# Altium schematic sheet Connectors.SchDoc
size A4; SheetNumber: 3; SheetTotal: 5
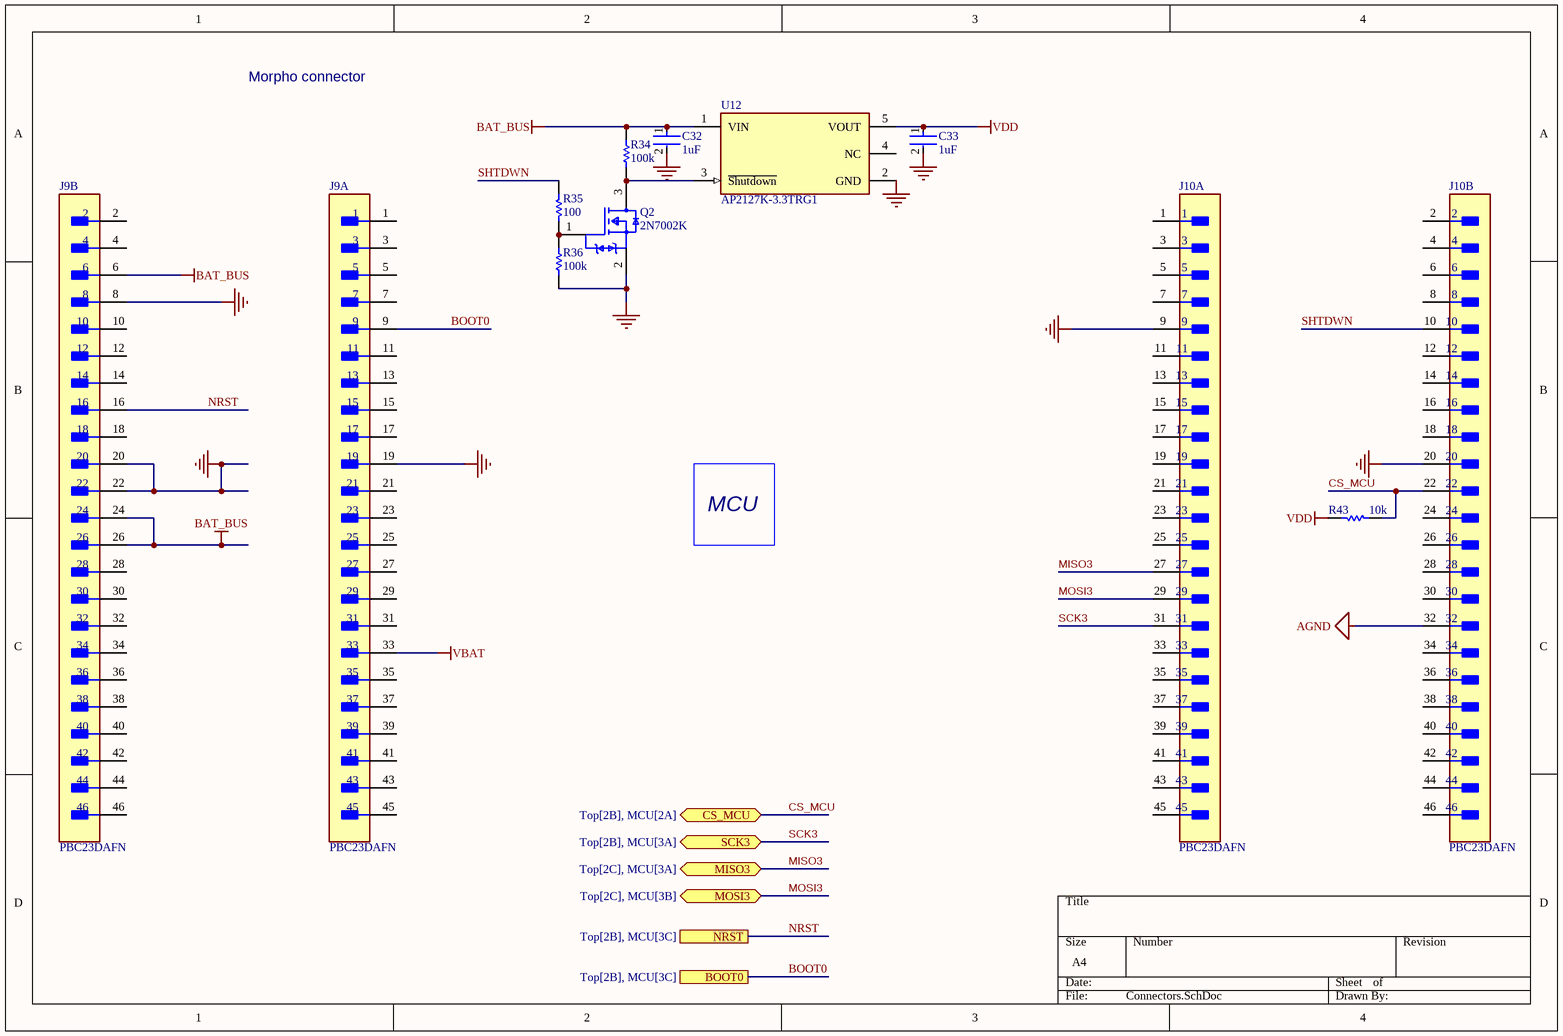
[diagram p0: Connectors.SchDoc]

## Parts
C32  1uF  [FP-0603-L_1_6_0_15-W_0_81-IPC_B]
C33  1uF  [FP-0603-L_1_6_0_15-W_0_81-IPC_B]
J9  PBC23DAFN  [FP-PBC23DAFN-MFG]  (parts A,B of 2)
J10  PBC23DAFN  [FP-PBC23DAFN-MFG]  (parts A,B of 2)
Q2  2N7002K  [FP-318-08-MFG]
R34  100k  [RESC1005X40X25NL05T10]
R35  100  [RESC1608X55X30LL15T15]
R36  100k  [RESC1005X40X25NL05T10]
R43  10k  [RESC1005X40X25LL05T05]
U12  AP2127K-3.3TRG1  [FP-SOT25-MFG]

## Ports
BOOT0 (see Top[2B], MCU[3C]), CS_MCU (bidir, see Top[2B], MCU[2A]), MISO3 (bidir, see Top[2C], MCU[3A]), MOSI3 (bidir, see Top[2C], MCU[3B]), NRST (see Top[2B], MCU[3C]), SCK3 (bidir, see Top[2B], MCU[3A])

## Nets
AGND: J10.32
BAT_BUS: C32.1 J9.6 J9.24 J9.26 R34.2 U12.1(VIN)
GND: C32.2 C33.2 J9.8 J9.19 J9.20 J9.22 J10.9 J10.20 Q2.2(Source) R36.1 U12.2(GND)
VBAT: J9.33
VDD: C33.1 R43.2 U12.5(VOUT)
BOOT0: J9.9 ; port BOOT0
CS_MCU: J10.22 R43.1 ; port CS_MCU
MISO3: J10.27 ; port MISO3
MOSI3: J10.29 ; port MOSI3
NRST: J9.16 ; port NRST
SCK3: J10.31 ; port SCK3
SHTDWN: J10.10 R35.2
NetQ2_1: Q2.1(Gate) R35.1 R36.2
NetQ2_3: Q2.3(Drain) R34.1 U12.3(~{Shutdown})

Not connected (* = marked no-connect by the designer): J9 1 2 3 4 5 7 10 11 12 13 14 15 17 18 21 23 25 27 28 29 30 31 32 34 35 36 37 38 39 40 41 42 43 44 45 46; J10 1 2 3 4 5 6 7 8 11 12 13 14 15 16 17 18 19 21 23 24 25 26 28 30 33 34 35 36 37 38 39 40 41 42 43 44 45 46; U12 4(NC)

## Notes on the sheet
- Morpho connector
- MCU

## Library data of the parts
C32 C33 = CMP-2006-04532-2: General Purpose Ceramic Capacitor, 0603, 1uF, 10%, X5R, 15%, 16V; Dissipation Factor: 12.5%; Insulation Resistance: 10GR; Case/Package: 0603; Depth: 0.81mm; Max Operating Temperature: 85°C; Number of Pins: 2; Thickness: 0.035inch; Packaging: Tape and Reel; RoHS Compliant: Yes; Construction: Flat; Mount: Surface Mount; Width: 0.81mm; Case Code (Metric): 1608; Voltage Rating (DC): 16V; Voltage: 16V; Height: 0.9mm; Capacitance: 1uF; Length: 1.6mm; Dielectric: X5R; Voltage Rating: 16V; Radiation Hardening: No; Series: -; Case Code (Imperial): 0603; Tolerance: 10%; Lead Free: Lead Free; Termination: SMD/SMT; Min Operating Temperature: -55°C; Package Quantity: 1; REACH SVHC: No SVHC
J9 J10 = CMP-25680-000057-1: CONN HEADER VERT 46POS 2.54MM; Connector Type: Male Pin; Gender: Male; Number of Contacts: 46; Pitch: 0.1inch; Mount: Through Hole; Height: 2.54mm; Housing Material: Plastic; Contact Plating: Gold; Length: 58.4mm; RoHS Compliant: Yes; Packaging: Bulk; Termination: Solder; Number of Rows: 2; Series: -; Lead Free: Lead Free; Row Spacing: 0.1inch; Contact Type: Male Pin; Contact Material: Bronze; Color: Black; Number of Positions: 46; Width: 5.08mm; Contact Mating Length: 0.23inch; Package Quantity: 1; Housing Color: Black
Q2 = CMP-07173-000009-1: MOSFET N-CH 60V 300MA SOT23; Manufacturer: ON Semiconductor; Turn Off Delay Time: 55.8ns; Max Forward Diode Voltage: 1.2V; Max Junction Temp: +150°C; Pulse Drain Current: 5A; Threshold Vgs Min: 1V; Depletion Mode: False; Drain To Source Resistance: 1.19Ω; Number Of N Channels: 1; Standoff Height: 0.01mm; Rthja Max: 417°C/W; Input Capacitace At Vds: 24.5pF @ 20V; Threshold Vgs Max: 2.3V; Turn On Delay Time: 12.2ns; Gate Charge At Vgs: 0.7nC @ 4.5V; Continuous Drain Current: 320mA; Transconductance: 0.53S; Power Dissipation: 300mW; Gate To Source Voltage: 20V; Typ Forward Diode Voltage: 0.8V; ComponentLink2URL: https://www.onsemi.com/pub/Collateral/2N7002K-D.pdf; RoHS: TRUE; Device Class L1: Discrete Semiconductors; ComponentLink2Description: Datasheet; Manufacturer Part Number: 2N7002K; Octopart: https://octopart.com/2n7002k-on+semiconductor-84408900; Device Class L3: MOSFETs; Mouser Description: N-Channel 60 V 2 Ohm SMT Enhancement Mode Field Effect Transistor SOT-23; Ipc Land Pattern Name: SOT95P240X100-3; Temperature Range High: +150°C; Temperature Range Low: -55°C; Lead Free: Yes; Height: 1.11mm; Package: 318-08; Footprint Url: https://www.onsemi.com/pub/Collateral/318-08.PDF; Temperature: -55°C to +150°C; Drain To Source Voltage: 60V; Device Class L2: Transistors; Drain To Source Breakdown Voltage: 60V; Digikey Description: MOSFET N-CH 60V 300MA SOT23; Number Of Channels: 1; Category: Trans; Automotive: No
R34 R36 = CMP-2002-07343-1: Part Number: RC0402FR-07100KL; Manufacturer: Yageo / Phycomp
R35 = CMP-2000-00179-1: Manufacturer: Panasonic; Part Number: ERJ-3EKF1000V
R43 = CMP-2000-07588-1: Chip Resistor, 10 KOhm, +/- 1%, 0.1 W, -55 to 155 degC, 0402 (1005 Metric), RoHS, Tape and Reel; Manufacturer: Panasonic; Power Rating: 100mW; Voltage Rating: 50V; Resistance: 10KOhm; Case\/Package: 0402; Temperature Coefficient: 100ppm\/degreesC; RoHSCompliant: True; Lead Free: LeadFree; Package Quantity: 1; Contact Plating: Tin; Length: 1mm; Radiation Hardening: No; REACH SVHC: NoSVHC; Max Operating Temperature: 155degC; Depth: 0.5mm; Case Code (Imperial): 0402; Military Standard: Not; Package Description: 2-Pin Surface Mount Device, Body 1 x 0.5 mm; Termination: SMD/SMT; Case Code (Metric): 1005; Height: 0.35mm; Packaging: TapeandReel; Voltage Rating (DC): 50V; Package Reference: 402; Number of Pins: 2; Tolerance: 1%; Mounting Technology: SurfaceMount; Width: 0.02inch; Mount: SurfaceMount; Datasheet URL: https://industrial.panasonic.com/cdbs/www-data/pdf/RDA0000/AOA0000C304.pdf; Composition: ThickFilm; Datasheet Version: 02/2017; Manufacturer URL: http://www.panasonic.com/; Max Power Dissipation: 100mW; Number of Terminations: 2; Min Operating Temperature: -55degC
U12 = CMP-12756-000001-1: IC REG LINEAR 3.3V 300MA SOT23-5; Manufacturer: Diodes Inc.; Output Type: Fixed; Max Junction Temp: +150°C; Max Supply Voltage: 6V; Nominal Supply Current: 60uA; Standoff Height: 0.013mm; Min Supply Voltage: 2.5V; Dropout Voltage: 170mV; Number Of Outputs: 1; Accuracy Percentage: 2%; Output Current: 400mA; Temperature Range Low: -40°C; Octopart: https://octopart.com/ap2127k-3.3trg1-diodes+inc.-30954597; Automotive: No; Mouser Description: LDO Voltage Regulators 300mA CMOS LDO 2.5V to 6V; Device Class L3: Voltage Regulators - Linear; Height: 1.4mm; Ambient Temperature Range Low: -40°C; Output Voltage: 3.3V; ComponentLink2Description: Datasheet; RoHS: TRUE; Digikey Description: IC REG LINEAR 3.3V 300MA SOT23-5; Device Class L1: Integrated Circuits (ICs); Device Class L2: Power Management ICs; Footprint Url: https://www.diodes.com/assets/Package-Files/SOT25.pdf; Temperature: -40°C to +85°C; Category: IC; Lead Free: Yes; Temperature Range High: +85°C; Manufacturer Part Number: AP2127K-3.3TRG1; Ambient Temperature Range High: +85°C; Package: SOT25; ComponentLink2URL: https://www.diodes.com/assets/Datasheets/AP2127.pdf